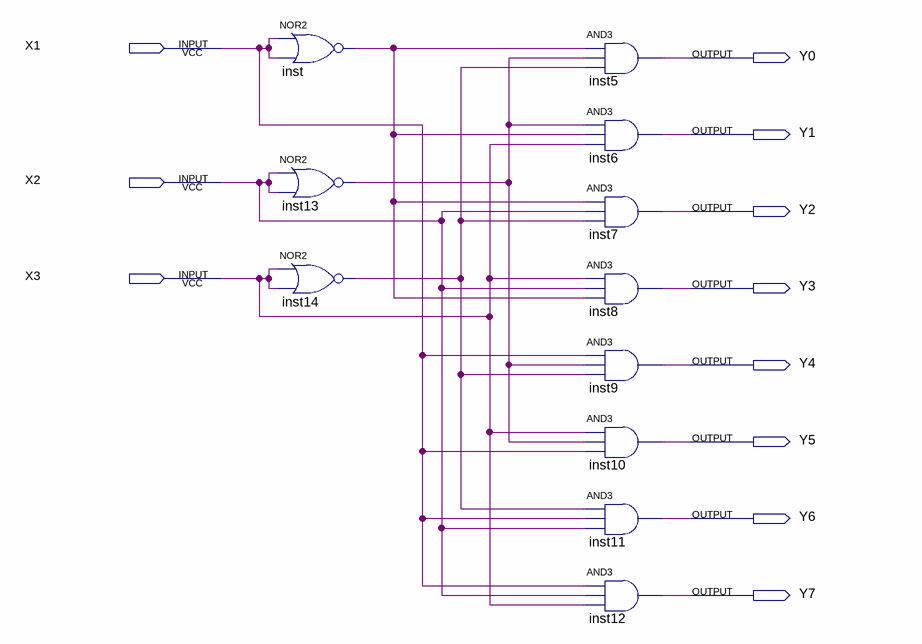
[diagram p0: schematic sheet]
// Quartus schematic desh.bdf as structural Verilog: 11 symbols, 11 pins
module desh (
  input  X1,
  input  X2,
  input  X3,
  output Y0,
  output Y1,
  output Y2,
  output Y3,
  output Y4,
  output Y5,
  output Y6,
  output Y7
);

  wire inst13_out, inst14_out, inst_out;

  nor inst (inst_out, X1, X1);
  nor inst13 (inst13_out, X2, X2);
  nor inst14 (inst14_out, X3, X3);
  and inst5 (Y0, inst_out, inst13_out, inst14_out);
  and inst6 (Y1, inst13_out, inst_out, X3);
  and inst7 (Y2, inst_out, X2, inst14_out);
  and inst8 (Y3, X3, X2, inst_out);
  and inst9 (Y4, X1, inst13_out, inst14_out);
  and inst10 (Y5, X3, inst13_out, X1);
  and inst11 (Y6, inst14_out, X1, X2);
  and inst12 (Y7, X1, X2, X3);
endmodule
